# Altium schematic sheet 2-RPI.SchDoc
size 420 x 297 mm; Engineer: Иванов; DocumentNumber: CONNECTORS; SheetNumber: 2; SheetTotal: 4
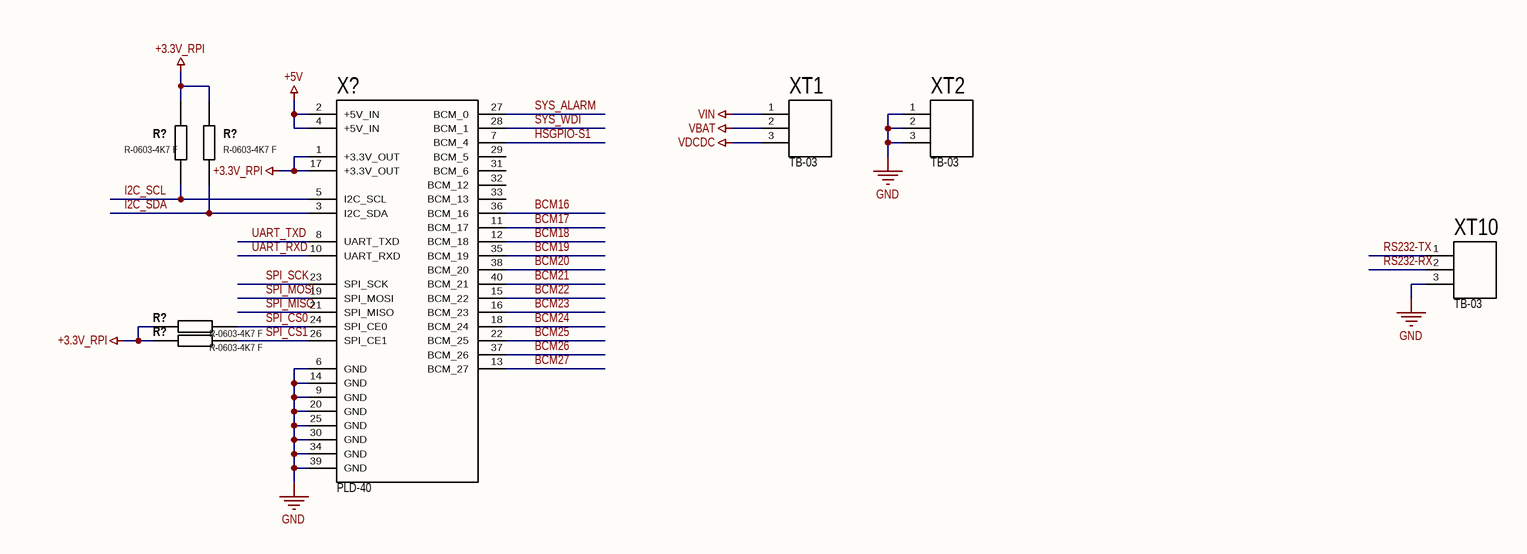
[diagram p0: 2-RPI.SchDoc]

## Parts
(Parts that share a designator on the sheet are numbered #1, #2 ... from top to bottom, then left to right.)
R?#1  R-0603-4K7 F  [RESC160X80X55L30N]
R?#2  R-0603-4K7 F  [RESC160X80X55L30N]
R?#3  R-0603-4K7 F  [RESC160X80X55L30N]
R?#4  R-0603-4K7 F  [RESC160X80X55L30N]
X?  PLD-40
XT1  TB-03  [HDRV3W63P254_3X1_762X571H1144]
XT2  TB-03  [HDRV3W63P254_3X1_762X571H1144]
XT10  TB-03  [HDRV3W63P254_3X1_762X571H1144]

## Nets
+3.3V_RPI: R?#1.2 R?#2.2 R?#3.2 R?#4.2 X?.1(+3.3V_OUT) X?.17(+3.3V_OUT)
+5V: X?.2(+5V_IN) X?.4(+5V_IN)
GND: X?.6(GND) X?.9(GND) X?.14(GND) X?.20(GND) X?.25(GND) X?.30(GND) X?.34(GND) X?.39(GND) XT2.1 XT2.2 XT2.3 XT10.3
VBAT: XT1.2
VDCDC: XT1.3
VIN: XT1.1
BCM16: X?.36(BCM_16)
BCM17: X?.11(BCM_17)
BCM18: X?.12(BCM_18)
BCM19: X?.35(BCM_19)
BCM20: X?.38(BCM_20)
BCM21: X?.40(BCM_21)
BCM22: X?.15(BCM_22)
BCM23: X?.16(BCM_23)
BCM24: X?.18(BCM_24)
BCM25: X?.22(BCM_25)
BCM26: X?.37(BCM_26)
BCM27: X?.13(BCM_27)
HSGPIO-S1: X?.7(BCM_4)
I2C_SCL: R?#1.1 X?.5(I2C_SCL)
I2C_SDA: R?#2.1 X?.3(I2C_SDA)
RS232-RX: XT10.2
RS232-TX: XT10.1
SPI_CS0: R?#3.1 X?.24(SPI_CE0)
SPI_CS1: R?#4.1 X?.26(SPI_CE1)
SPI_MISO: X?.21(SPI_MISO)
SPI_MOSI: X?.19(SPI_MOSI)
SPI_SCK: X?.23(SPI_SCK)
SYS_ALARM: X?.27(BCM_0)
SYS_WDI: X?.28(BCM_1)
UART_RXD: X?.10(UART_RXD)
UART_TXD: X?.8(UART_TXD)

Not connected (* = marked no-connect by the designer): X? 29(BCM_5) 31(BCM_6) 32(BCM_12) 33(BCM_13)

## Notes on the sheet
- Подп. и дата
- Инв.№ дубл.
- Взам.инв.№
- Подп.и дата
- Инв.№ подл.
- Изм.
- Лист
- № докум.
- Подп.
- Дата
- Копировал
- Формат  A3

## Library data of the parts
R?#1-R?#4 = R: General resistor; Manufacturer: Yageo; Mount_Type: Auto; Component_Type: Резистор; Tolerance: 1%; Value: 4.7k; Partnumber: *; Size: 0603; PnP_Name: R-0603-4K7 F; UID: R-0603-4K7 F
X? = Conn_2x20_RPI: Manufacturer: KLS; Component_Type: Разъём; Mount_Type: Manual; Partnumber: PLD-40; UID: X-PLD-40
XT1 XT2 XT10 = Conn_3: Manufacturer: KLS; Component_Type: Клеммник; Mount_Type: Manual; Partnumber: TB-03; UID: X-TB-03